# EAGLE design PCM2706 & PCM5102A (EAGLE 7.4.0)
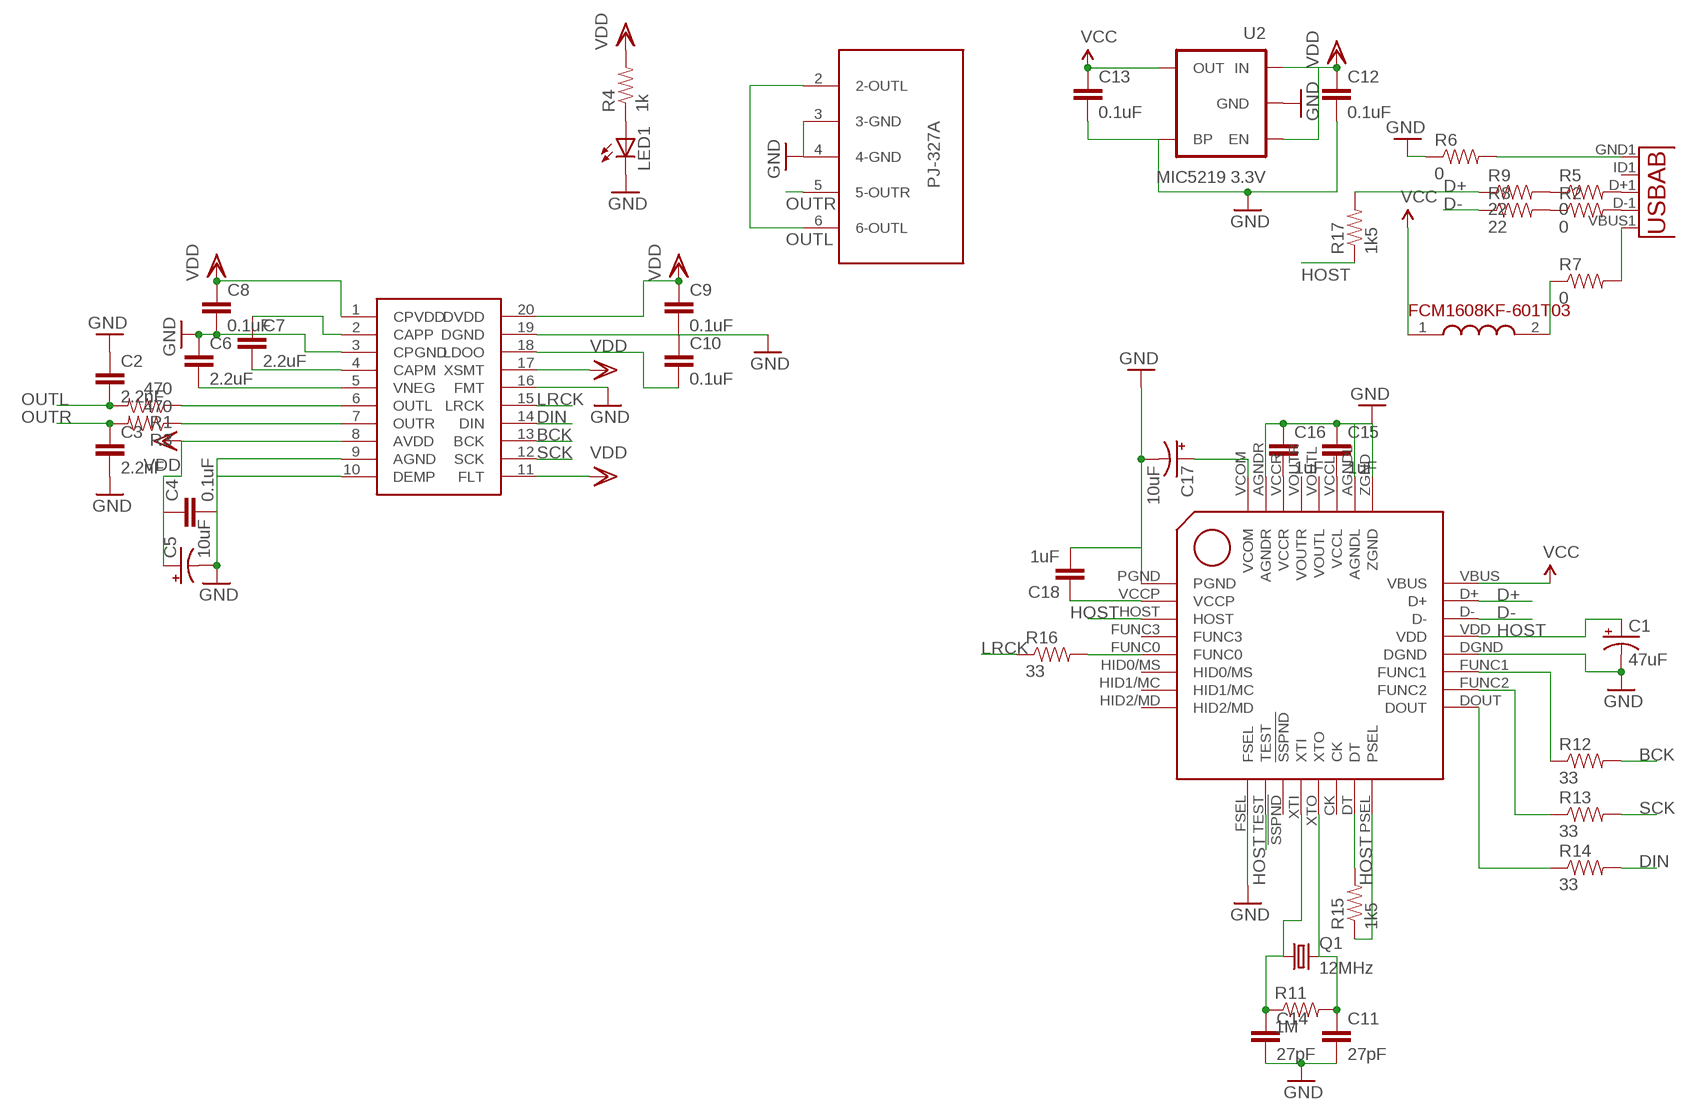
[diagram p0: schematic, sheet 1]

## Parts
C1  47uF  CAP_POLF80  [NIPPON_F80]
C2  2.2nF  C5/2.5  [C5B2.5]
C3  2.2nF  C5/2.5  [C5B2.5]
C4  0.1uF  2.2UF-CERCAP-10009  [1206]
C5  10uF  CAP_POLF80  [NIPPON_F80]
C6  2.2uF  2.2UF-CERCAP-10009  [1206]
C7  2.2uF  2.2UF-CERCAP-10009  [1206]
C8  0.1uF  2.2UF-CERCAP-10009  [1206]
C9  0.1uF  2.2UF-CERCAP-10009  [1206]
C10  0.1uF  2.2UF-CERCAP-10009  [1206]
C11  27pF  2.2UF-CERCAP-10009  [1206]
C12  0.1uF  2.2UF-CERCAP-10009  [1206]
C13  0.1uF  2.2UF-CERCAP-10009  [1206]
C14  27pF  2.2UF-CERCAP-10009  [1206]
C15  1uF  2.2UF-CERCAP-10009  [1206]
C16  1uF  2.2UF-CERCAP-10009  [1206]
C17  10uF  CAP_POLF80  [NIPPON_F80]
C18  1uF  2.2UF-CERCAP-10009  [1206]
LED1  LEDCHIP-LED0805  [CHIP-LED0805]
Q1  12MHz  CRYSTALSM49  [SM49]
R1  470  RESISTOR1206  [1206]
R2  0  RESISTOR0805-RES  [0805]
R3  470  RESISTOR1206  [1206]
R4  1k  RESISTOR1206  [1206]
R5  0  RESISTOR0805-RES  [0805]
R6  0  RESISTOR0805-RES  [0805]
R7  0  RESISTOR0805-RES  [0805]
R8  22  RESISTOR0805-RES  [0805]
R9  22  RESISTOR0805-RES  [0805]
R11  1M  RESISTOR0805-RES  [0805]
R12  33  RESISTOR0805-RES  [0805]
R13  33  RESISTOR0805-RES  [0805]
R14  33  RESISTOR0805-RES  [0805]
R15  1k5  RESISTOR0805-RES  [0805]
R16  33  RESISTOR0805-RES  [0805]
R17  1k5  RESISTOR0805-RES  [0805]
U1  USB""  [USB-MICRO-SMD]
U2  MIC5219 3.3V  V_REG_MIC52193.3V  [SOT23-5]
U$1  PCM5102  [TSSOP20]
U$2  PJ-327A  [PJ-327A]
U$3  PCM2706  [TQFP32-08]
U$4  FCM1608KF-601T03  [FCM1608KF-601T03]

## Nets
BCK: R12.2 U$1.13(BCK)
D+: R9.1 R17.2 U$3.D+
D-: R8.1 U$3.D-
DIN: R14.2 U$1.14(DIN)
GND: C1.- C2.1 C3.2 C4.2 C5.- C6.1 C8.2 C9.2 C10.1 C11.2 C12.2 C13.2 C14.2 C15.1 C16.1 C17.- C18.2 LED1.C R6.1 U2.2(GND) U2.4(BP) U$1.3(CPGND) U$1.9(AGND) U$1.10(DEMP) U$1.16(FMT) U$1.19(DGND) U$2.3(3-GND) U$2.4(4-GND) U$3.AGNDL U$3.AGNDR U$3.DGND U$3.FSEL U$3.PGND U$3.ZGND
HOST: C1.+ R15.1 R17.1 U$3.HOST U$3.PSEL U$3.TEST U$3.VDD
LRCK: R16.1 U$1.15(LRCK)
N$1: C7.1 U$1.2(CAPP)
N$2: LED1.A R4.1
N$3: R7.2 U1.VBUS1(VBUS)
N$4: R2.2 U1.D-1(D-)
N$5: R5.2 U1.D+1(D+)
N$6: C7.2 U$1.4(CAPM)
N$7: R3.1 U$1.7(OUTR)
N$8: R1.1 U$1.6(OUTL)
N$9: C6.2 U$1.5(VNEG)
N$10: C10.2 U$1.18(LDOO)
N$11: R7.1 U$4.2(2.OUT)
N$12: R6.2 U1.GND1(GND)
N$13: R5.1 R9.2
N$14: R2.1 R8.2
N$15: C14.1 Q1.1 R11.1 U$3.XTI
N$16: C11.1 Q1.2 R11.2 U$3.XTO
N$17: R15.2 U$3.DT
N$18: R14.1 U$3.DOUT
N$19: R13.1 U$3.FUNC2
N$20: R12.1 U$3.FUNC1
N$21: C15.2 U$3.VCCL
N$22: R16.2 U$3.FUNC0
N$25: C16.2 U$3.VCCR
N$26: C17.+ U$3.VCOM
N$27: C18.1 U$3.VCCP
OUTL: C2.2 R1.2 U$2.2(2-OUTL) U$2.6(6-OUTL)
OUTR: C3.1 R3.2 U$2.5(5-OUTR)
SCK: R13.2 U$1.12(SCK)
VCC: C13.1 U2.5(OUT) U$3.VBUS U$4.1(1.IN)
VDD: C4.1 C5.+ C8.1 C9.1 C12.1 R4.2 U2.1(IN) U2.3(EN) U$1.1(CPVDD) U$1.8(AVDD) U$1.11(FLT) U$1.17(XSMT) U$1.20(DVDD)
Unconnected: U1.ID1(USBID) U$3.!SSPND U$3.CK U$3.FUNC3 U$3.HID0/MS U$3.HID1/MC U$3.HID2/MD U$3.VOUTL U$3.VOUTR

## Library data of the parts
C1 C5 C17 = SparkFun-Capacitors:CAP_POL: Capacitor Polarized These are standard SMD and PTH capacitors. Normally 10uF, 47uF, and 100uF in electrolytic and tantalum varieties. Always verify the external diameter of the through hole cap, it varies with capacity, voltage, and manufacturer. The EIA devices should be standard.
C2 C3 = capacitor-wima:C: CAPACITOR naming: grid - package width
C4 C8-C16 C18 = SparkFun-Capacitors:2.2UF-CER: 2.2uF Ceramic SMT CAP-07888- 10V, 20% (0603) CAP-10009- 50V, 10% (1206); PROD_ID: CAP-10009; VALUE: 2.2uF
C6 C7 = SparkFun-Capacitors:2.2UF-CER: 2.2uF Ceramic SMT CAP-07888- 10V, 20% (0603) CAP-10009- 50V, 10% (1206); PROD_ID: CAP-10009
LED1 = adafruit:LED: LED OSRAM: - CHIPLED LG R971, LG N971, LY N971, LG Q971, LY Q971, LO R971, LY R971 LH N974, LH R974 LS Q976, LO Q976, LY Q976 LO Q996 - Hyper CHIPLED LW Q18S LB Q993, LB Q99A, LB R99A - SideLED LS A670, LO A670, LY A670, LG A670, LP A670 LB A673, LV A673, LT A673, LW A673 LH A674 LY A675 LS A676, LA A676, LO A676, LY A676, LW A676 LS A679, LY A679, LG A679 - Hyper Micro SIDELED® LS Y876, LA Y876, LO Y876, LY Y876 LT Y87S - SmartLED LW L88C, LW L88S LB L89C, LB L89S, LG L890 LS L89K, LO L89K, LY L89K LS L896, LA L896, LO L896, LY L896 - TOPLED LS T670, LO T670, LY T670, LG T670, LP T670 LSG T670, LSP T670, LSY T670, LOP T670, LYG T670 LG T671, LOG T671, LSG T671 LB T673, LV T673, LT T673, LW T673 LH T674 LS T676, LA T676, LO T676, LY T676, LB T676, LH T676, LSB T676, LW T676 LB T67C, LV T67C, LT T67C, LS T67K, LO T67K, LY T67K, LW E67C LS E67B, LA E67B, LO E67B, LY E67B, LB E67C, LV E67C, LT E67C LW T67C LS T679, LY T679, LG T679 LS T770, LO T770, LY T770, LG T770, LP T770 LB T773, LV T773, LT T773, LW T773 LH T774 LS E675, LA E675, LY E675, LS T675 LS T776, LA T776, LO T776, LY T776, LB T776 LHGB T686 LT T68C, LB T68C - Hyper Mini TOPLED® LB M676 - Mini TOPLED Santana® LG M470 LS M47K, LO M47K, LY M47K Source: http://www.osram.convergy.de/
Q1 = adafruit:CRYSTAL: CRYSTAL; OC_FARNELL: unknown; OC_NEWARK: unknown
R1-R9 R11-R17 = SparkFun-Resistors:RESISTOR: Resistor Basic schematic elements and footprints for 0603, 1206, and PTH resistors.
U1 = MicroUSB:USB: This is a USB AB connector that is compatible with USB OTG. i.e. this connector can serve as a host or device
U2 = SparkFun-PowerIC:V_REG_MIC5219: V_REG MIC5219 Standard 3.3V and 5V 500mA LDO voltage regulator in SOT-23 layout. Micrel part MIC5219. BP (by-pass) pin is used to lower output noise with 470pF cap, may be left open.; PROD_ID: VREG-09872
U$1 = adafruit:PCM5102
U$2 = PJ-327A:PJ-327A
U$3 = pcm2706:PCM2706: Texas Instruments' Audio Dac.
U$4 = FCM1608KF-601T03:FCM1608KF-601T03

## Board
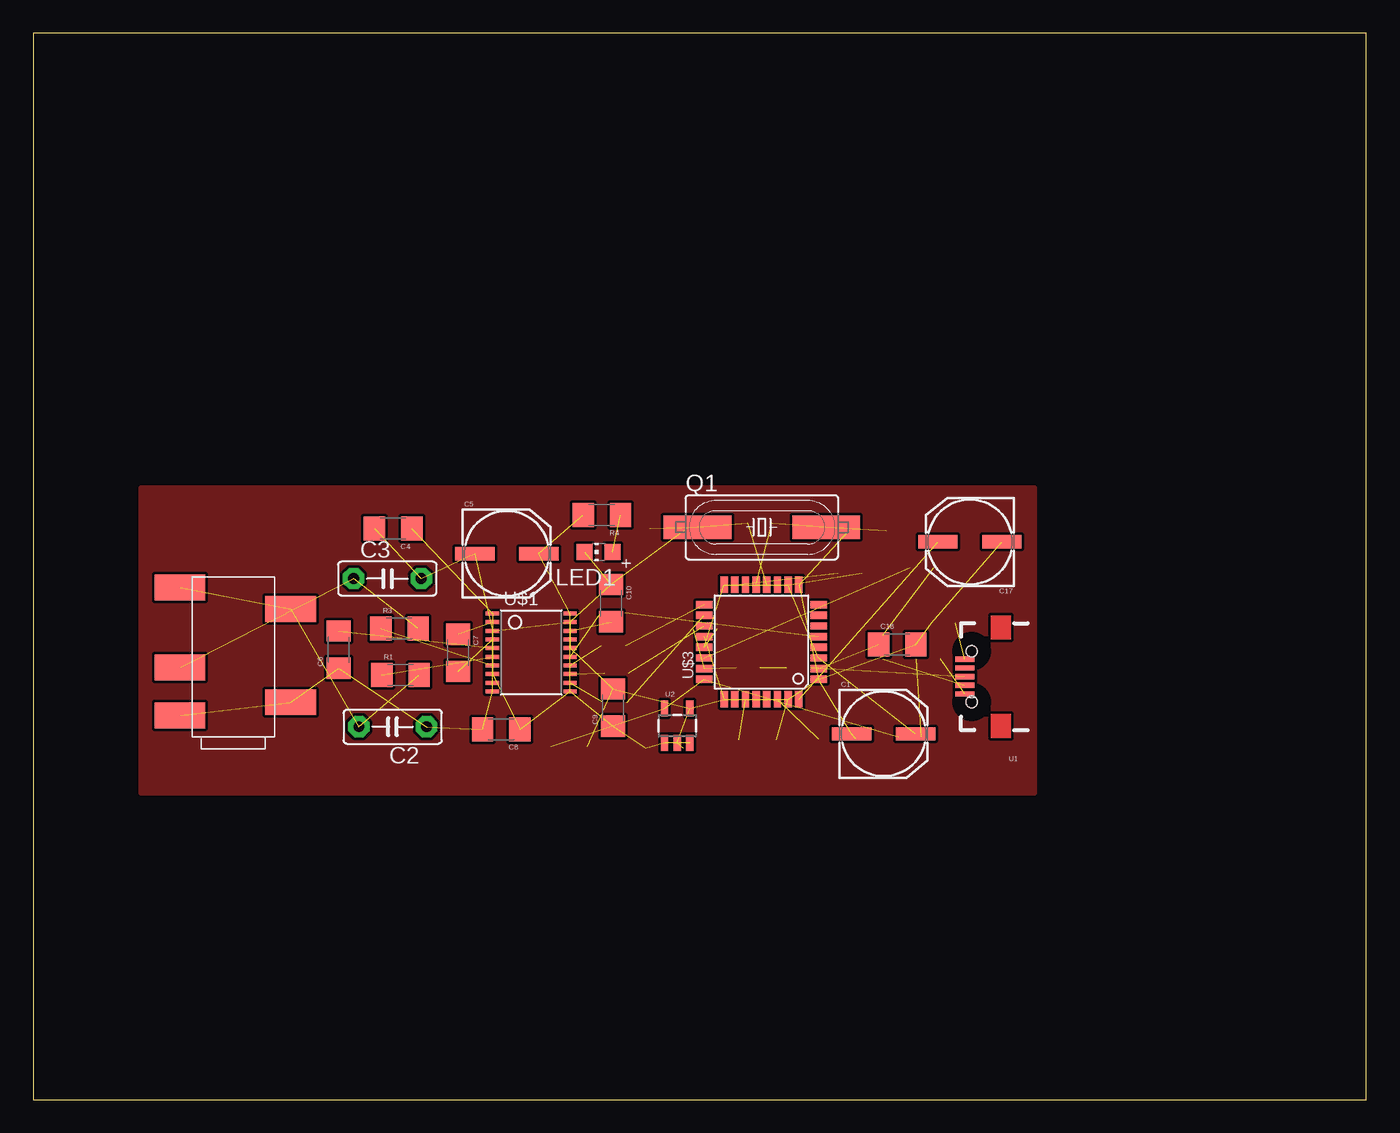
[diagram p1: board, top side]
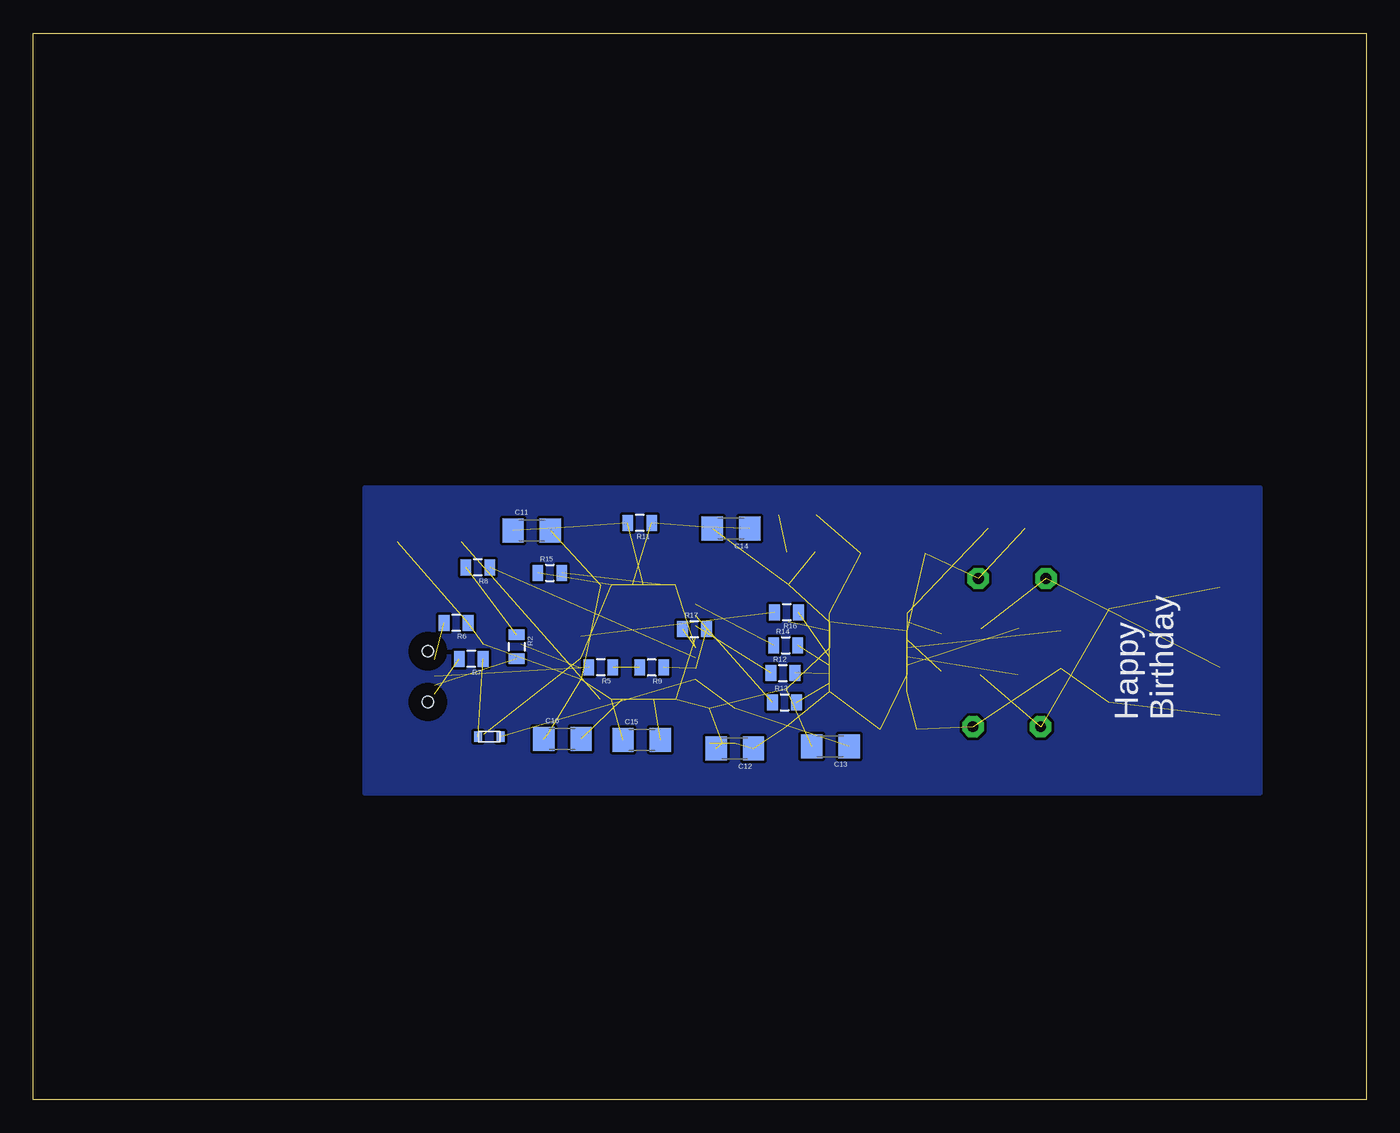
[diagram p2: board, bottom side, seen from below]

Size 100 x 80 mm. Coordinates in mm from the lower left corner, seen from the top.
Outline: 0,0 100,0 100,80 0,80 0,0
Copper layers (1*16): Top 0.035mm / dielectric 1.5mm / Bottom 0.035mm
Design rules "default": minimum track width 10mil, minimum drill 24mil, track to track 8mil, track to pad 8mil, pad to pad 8mil, via to via 8mil, smd to smd 8mil, copper to edge 40mil, drill to drill 8mil, minimum pad ring 10mil, minimum via ring 8mil, stop-mask expansion 4mil, vias tented up to drill 0mil, thermal gap 10mil

### Footprints (pad centres in the part's own frame; a part is rotated, then mirrored left to right if it is on the bottom)
NIPPON_F80 = smd 2.95 x 1: + 2.4,0; - -2.4,0
C5B2.5 = drill 0.813 pad 1.6 octagon: 1 -2.54,0; 2 2.54,0
1206 = smd 1.6 x 1.8: 1 -1.4,0; 2 1.4,0
CHIP-LED0805 = smd 1.2 x 1.2: A 0,-1.05; C 0,1.05
SM49 = smd 5.08 x 1.778: 1 -4.826,0; 2 4.826,0
0805 = smd 0.8 x 1.2: 1 -0.9,0; 2 0.9,0
USB-MICRO-SMD = smd 1.4 x 0.4: D+1 2.7,0; D-1 2.7,0.65; GND1 2.7,-1.3; ID1 2.7,-0.65; VBUS1 2.7,1.3 | hole 0.85: 2.2,1.9; 2.2,-1.9
SOT23-5 = smd 0.55 x 1.2: 1 -0.95,-1.3; 2 0,-1.3; 3 0.95,-1.3; 4 0.95,1.3; 5 -0.95,1.3
TSSOP20 = smd 0.305 x 0.991: 1 -2.925,-2.918; 2 -2.275,-2.918; 3 -1.625,-2.918; 4 -0.975,-2.918; 5 -0.325,-2.918; 6 0.325,-2.918; 7 0.975,-2.918; 8 1.625,-2.918; 9 2.275,-2.918; 10 2.925,-2.918; 11 2.925,2.918; 12 2.275,2.918; 13 1.625,2.918; 14 0.975,2.918; 15 0.325,2.918; 16 -0.325,2.918; 17 -0.975,2.918; 18 -1.625,2.918; 19 -2.275,2.918; 20 -2.925,2.918
PJ-327A = smd 1.93 x 3.81: 2 9.1,-6.8; 3 2.1,-6.8; 4 1.1,1.5; 5 4.7,1.5; 6 10.7,1.5
TQFP32-08 = smd 1.27 x 0.559: !SSPND 4.293,-1.2; AGNDL -4.293,2; AGNDR -4.293,-2; CK 4.293,1.2; DT 4.293,2; FSEL 4.293,-2.8; PSEL 4.293,2.8; TEST 4.293,-2; VCCL -4.293,1.2; VCCR -4.293,-1.2; VCOM -4.293,-2.8; VOUTL -4.293,0.4; VOUTR -4.293,-0.4; XTI 4.293,-0.4; XTO 4.293,0.4; ZGND -4.293,2.8 | smd 0.559 x 1.27: D+ -2,4.293; D- -1.2,4.293; DGND 0.4,4.293; DOUT 2.8,4.293; FUNC0 0.4,-4.293; FUNC1 1.2,4.293; FUNC2 2,4.293; FUNC3 -0.4,-4.293; HID0/MS 1.2,-4.293; HID1/MC 2,-4.293; HID2/MD 2.8,-4.293; HOST -1.2,-4.293; PGND -2.8,-4.293; VBUS -2.8,4.293; VCCP -2,-4.293; VDD -0.4,4.293
FCM1608KF-601T03 = smd 0.6 x 0.8: 1 -0.05,0.4; 2 1.65,0.4

### Placement (x,y rotation side)
C1  63.79,27.43 0 top
C2  26.96,27.97 180 top
C3  26.56,39.09 0 top
C4  26.99,42.83 180 top
C5  35.52,40.96 0 top
C6  22.89,33.76 90 top
C7  31.86,33.52 270 top
C8  35.1,27.78 180 top
C9  43.5,29.41 90 top
C10  43.35,37.24 270 top
C11  62.61,42.71 0 bottom
C12  47.37,26.34 180 bottom
C13  40.19,26.49 180 bottom
C14  47.66,42.86 180 bottom
C15  54.36,26.99 0 bottom
C16  60.31,27.07 0 bottom
C17  70.27,41.85 180 top
C18  64.82,34.15 0 top
LED1  42.42,41.08 90 top
Q1  54.66,42.94 0 top
R1  27.54,31.85 0 top
R2  63.74,33.97 270 bottom
R3  27.47,35.33 0 top
R4  42.65,43.85 180 top
R5  57.42,32.43 180 bottom
R6  68.28,35.77 180 bottom
R7  67.15,33.06 180 bottom
R8  66.65,39.92 180 bottom
R9  53.61,32.41 180 bottom
R11  54.51,43.26 180 bottom
R12  43.76,31.99 0 bottom
R13  43.64,29.81 0 bottom
R14  43.54,34.08 0 bottom
R15  61.25,39.52 0 bottom
R16  43.49,36.55 180 bottom
R17  50.4,35.3 0 bottom
U1  72.6,31.73 180 top
U2  48.31,28.04 0 top
U$1  37.36,33.54 270 top
U$2  12.5,27.71 90 top
U$3  54.63,34.33 90 top
U$4  64.98,27.62 180 bottom

### Tracks (layer width: path | path; a pad name or v marks a point on that pad's centre or on a via)
BCK  (1 unrouted)
D+  (2 unrouted)
D-  (1 unrouted)
DIN  (1 unrouted)
GND  (33 unrouted)
HOST  (6 unrouted)
LRCK  (1 unrouted)
N$1  (1 unrouted)
N$2  (1 unrouted)
N$3  (1 unrouted)
N$4  (1 unrouted)
N$5  (1 unrouted)
N$6  (1 unrouted)
N$7  (1 unrouted)
N$8  (1 unrouted)
N$9  (1 unrouted)
N$10  (1 unrouted)
N$11  (1 unrouted)
N$12  (1 unrouted)
N$13  (1 unrouted)
N$14  (1 unrouted)
N$15  (3 unrouted)
N$16  (3 unrouted)
N$17  (1 unrouted)
N$18  (1 unrouted)
N$19  (1 unrouted)
N$20  (1 unrouted)
N$21  (1 unrouted)
N$22  (1 unrouted)
N$23
  pour Bottom: 8,45.9 75.1,45.9 75.1,23 8,23
N$24
  pour Top: 8.1,45.9 75.1,45.9 75.1,23 8.1,23
N$25  (1 unrouted)
N$26  (1 unrouted)
N$27  (1 unrouted)
OUTL  (3 unrouted)
OUTR  (2 unrouted)
SCK  (1 unrouted)
VCC  (3 unrouted)
VDD  (12 unrouted)

### Text on the board
Vias: Stella | GCY
bPlace: Happy / Birthday